# Altium schematic sheet SHEET1.SCHDOC
size B
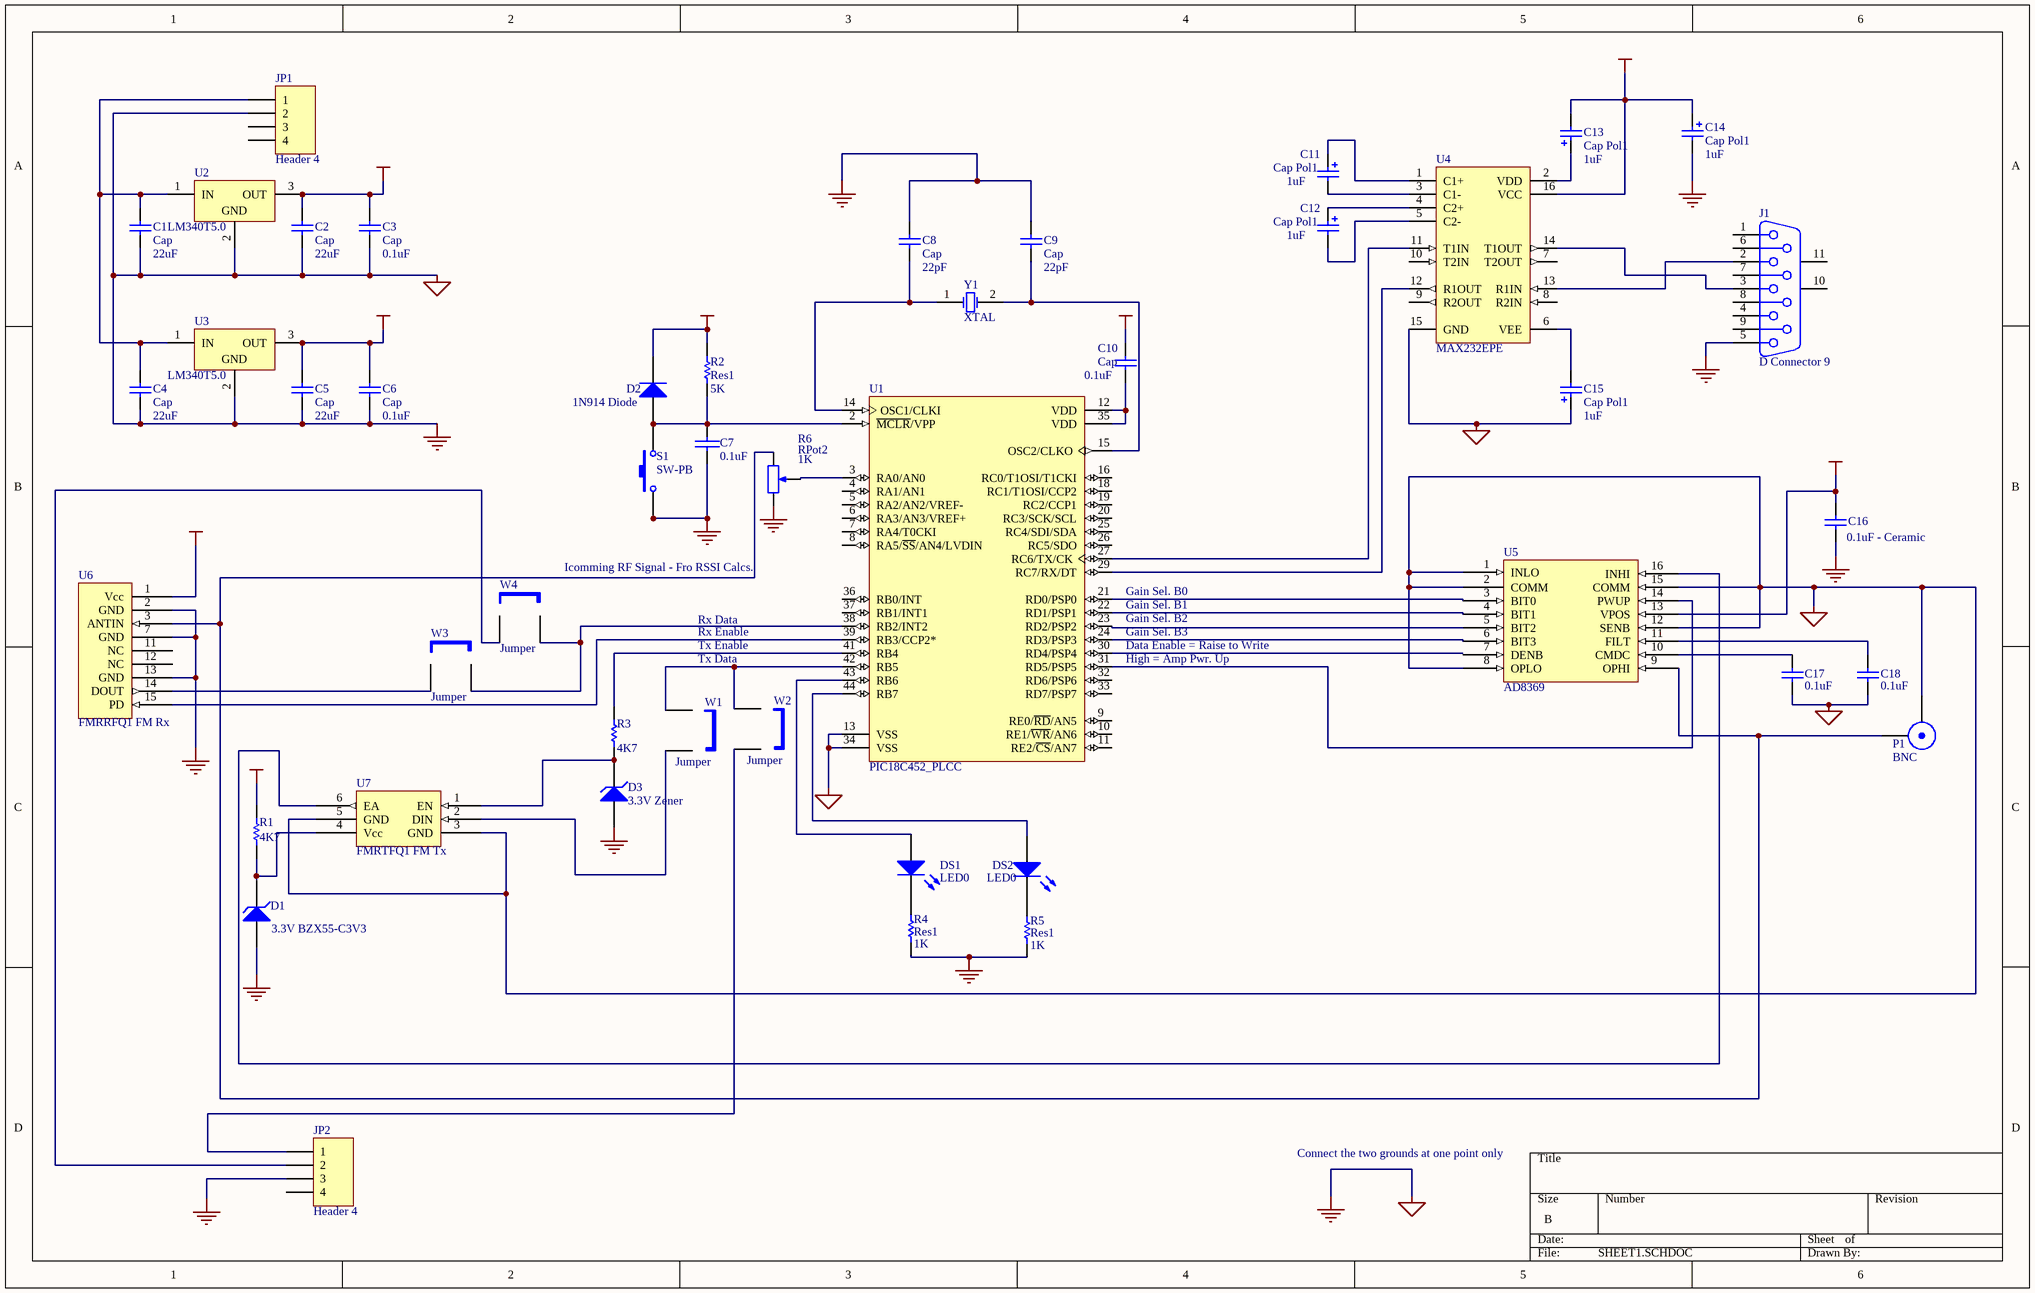
[diagram p0: SHEET1.SCHDOC]

## Parts
C1  Cap  value 22uF  [2mm Pol. Cap]
C2  Cap  value 22uF  [2mm Pol. Cap]
C3  Cap  value 0.1uF  [5mm Tant. Cap]
C4  Cap  value 22uF  [2mm Pol. Cap]
C5  Cap  value 22uF  [2mm Pol. Cap]
C6  Cap  value 0.1uF  [5mm Tant. Cap]
C7  0.1uF  [5mm Tant. Cap]
C8  Cap  value 22pF  [5.6mm Ceramic Cap]
C9  Cap  value 22pF  [5.6mm Ceramic Cap]
C10  Cap  value 0.1uF  [5mm Tant. Cap]
C11  Cap Pol1  value 1uF  [2mm Pol. Cap]
C12  Cap Pol1  value 1uF  [2mm Pol. Cap]
C13  Cap Pol1  value 1uF  [2mm Pol. Cap]
C14  Cap Pol1  value 1uF  [2mm Pol. Cap]
C15  Cap Pol1  value 1uF  [2mm Pol. Cap]
C16  value 0.1uF - Ceramic  [5mm Tant. Cap]
C17  value 0.1uF  [5mm Tant. Cap]
C18  value 0.1uF  [5mm Tant. Cap]
D1  3.3V BZX55-C3V3  [DIO7.1-3.9X1.9]
D2  1N914 Diode  [DIO7.1-3.9X1.9]
D3  3.3V Zener  [DIO7.1-3.9X1.9]
DS1  LED0  [LED]
DS2  LED0  [LED]
J1  D Connector 9  [DSUB1.385-2H9]
JP1  Header 4  [4 Way Terminal Block]
JP2  Header 4  [4 Way Terminal Block]
P1  BNC  [PCB BNC Connector - duplicate]
R1  value 4K7  [AXIAL-0.3]
R2  Res1  value 5K  [AXIAL-0.3]
R3  value 4K7  [AXIAL-0.3]  (hidden comment: Res1)
R4  Res1  value 1K  [AXIAL-0.3]
R5  Res1  value 1K  [AXIAL-0.3]
R6  RPot2  value 1K  [VR2]
S1  SW-PB  [Reset Switch - duplicate]
U1  PIC18C452_PLCC  [PLCC Socket 44 way]
U2  LM340T5.0  [SFM-T3/A4.7V]
U3  LM340T5.0  [SFM-T3/A4.7V]
U4  MAX232EPE  [DIP-16/X1.5]
U5  AD8369  [24 pin DIP socket for TSSOP]
U6  FMRRFQ1 FM Rx  [FMRRFQ1]
U7  FMRTFQ1 FM Tx  [FMRTFQ1]
W1  Jumper  [RAD-0.1]
W2  Jumper  [RAD-0.1]
W3  Jumper  [RAD-0.1]
W4  Jumper  [RAD-0.1]
Y1  XTAL  [XTAL]

## Nets
GND: C1.2 C2.2 C3.2 C4.2 C5.2 C6.2 C7.2 C8.2 C9.2 C14.2 C15.1 C16.2 C17.2 C18.2 D1.1(A) D3.1(A) J1.5 JP1.2 JP2.3 P1.2(Y) R4.2 R5.2 R6.1(TOP) S1.1 U1.13(VSS) U1.34(VSS) U2.2(GND) U3.2(GND) U4.15(GND) U5.12(SENB) U5.15(COMM) U6.2(GND) U6.7(GND) U6.13(GND) U7.3(GND) U7.5(GND)  [also labelled SGND]
VCC: C2.1 C3.1 C13.2 C14.1 C16.1 D2.2(K) R1.2 R2.2 U2.3(OUT) U4.16(VCC) U5.13(VPOS) U6.1(Vcc)
VDD: C5.1 C6.1 C10.1 U3.3(OUT)
NetC1_1: C1.1 C4.1 JP1.1 U2.1(IN) U3.1(IN)
NetC7_1: C7.1 D2.1(A) R2.1 S1.2 U1.2(~{MCLR}/VPP)
NetC8_1: C8.1 U1.14(OSC1/CLKI) Y1.1(OSC1)
NetC9_1: C9.1 U1.15(OSC2/CLKO) Y1.2(OSC2)
NetC10_2: C10.2 U1.12(VDD) U1.35(VDD)
NetC11_1: C11.1 U4.1(C1+)
NetC11_2: C11.2 U4.3(C1-)
NetC12_1: C12.1 U4.4(C2+)
NetC12_2: C12.2 U4.5(C2-)
NetC13_1: C13.1 U4.2(VDD)
NetC15_2: C15.2 U4.6(VEE)
NetC17_1: C17.1 U5.10(CMDC)
NetC18_1: C18.1 U5.11(FILT)
NetD1_2: D1.2(K) R1.1 U7.4(Vcc)
NetD3_2: D3.2(K) R3.1 U7.1(EN)
NetDS1_1: DS1.1(A) U1.43(RB6)
NetDS1_2: DS1.2(K) R4.1
NetDS2_1: DS2.1(A) U1.44(RB7)
NetDS2_2: DS2.2(K) R5.1
NetJ1_2: J1.2 U4.13(R1IN)
NetJ1_3: J1.3 U4.14(T1OUT)
NetJP2_1: JP2.1 W2.2
NetJP2_2: JP2.2 W4.1
NetP1_1: P1.1(X) R6.2(BOT) U5.9(OPHI) U6.3(ANTIN)
NetR3_2: R3.2 U1.41(RB4)
NetR6_3: R6.3(TAP) U1.3(RA0/AN0)
NetU1_21: U1.21(RD0/PSP0) U5.3(BIT0)
NetU1_22: U1.22(RD1/PSP1) U5.4(BIT1)
NetU1_23: U1.23(RD2/PSP2) U5.5(BIT2)
NetU1_24: U1.24(RD3/PSP3) U5.6(BIT3)
NetU1_27: U1.27(RC6/TX/CK) U4.11(T1IN)
NetU1_29: U1.29(RC7/RX/DT) U4.12(R1OUT)
NetU1_31: U1.31(RD5/PSP5) U5.14(PWUP)
NetU1_38: U1.38(RB2/INT2) W3.2 W4.2
NetU1_39: U1.39(RB3/CCP2*) U6.15(PD)
NetU1_42: U1.42(RB5) W1.1 W2.1
NetU5_1: U5.1(INLO) U5.2(COMM) U5.8(OPLO)
NetU5_16: U5.16(INHI) U7.6(EA)
NetU6_14: U6.14(DOUT) W3.1
NetU7_2: U7.2(DIN) W1.2

Not connected (* = marked no-connect by the designer): J1 1 4 6 7 8 9 10(MH1) 11(MH2); JP1 3 4; JP2 4; U1 4(RA1/AN1) 5(RA2/AN2/VREF-) 6(RA3/AN3/VREF+) 7(RA4/T0CKI) 8(RA5/~{SS}/AN4/LVDIN) 9(RE0/~{RD}/AN5) 10(RE1/~{WR}/AN6) 11(RE2/~{CS}/AN7) 16(RC0/T1OSI/T1CKI) 18(RC1/T1OSI/CCP2) 19(RC2/CCP1) 20(RC3/SCK/SCL) 25(RC4/SDI/SDA) 26(RC5/SDO) 30(RD4/PSP4) 32(RD6/PSP6) 33(RD7/PSP7) 36(RB0/INT) 37(RB1/INT1); U4 7(T2OUT) 8(R2IN) 9(R2OUT) 10(T2IN); U5 7(DENB); U6 11(NC) 12(NC)

## Notes on the sheet
- Icomming RF Signal - Fro RSSI Calcs.
- Rx Data
- Rx Enable
- (near U1) Gain Sel. B3
- (near U1) Gain Sel. B2
- (near U1) Gain Sel. B1
- (near U1) Gain Sel. B0
- Tx Enable
- Tx Data
- (near U1) High = Amp Pwr. Up
- (near U1) Data Enable = Raise to Write
- Connect the two grounds at one point only

## Library data of the parts
C1-C6 C8-C10 C16-C18 = Cap: Capacitor; Manufacturer: Generic Components; Class I: Passive; Published: 8-Jun-2000; Revision: July-2002: Re-released for DXP Platform.; Publisher: Altium Limited; Class II: Capacitor
C7 = CAP: Capacitor
C11-C15 = Cap Pol1: Polarized Capacitor (Radial); Manufacturer: Generic Components; Class I: Passive; Published: 8-Jun-2000; Revision: July-2002: Re-released for DXP Platform.; Publisher: Altium Limited; Class II: Capacitor
D1 D3 = D Zener: Zener Diode; Manufacturer: Generic Components; Class I: Discrete; Class II: Diode - Zener; Published: 8-Jun-2000; Revision: July-2002: Re-released for DXP Platform.; Publisher: Altium Limited
D2 = Diode: Default Diode; Manufacturer: Generic Components; Class I: Discrete; Class II: Diode - Switching; Published: 8-Jun-2000; Revision: July-2002: Re-released for DXP Platform.; Publisher: Altium Limited
DS1 DS2 = LED0: Typical INFRARED GaAs LED; Manufacturer: Generic Components; Class I: Optoelectronic; Published: 8-Jun-2000; Revision: July-2002: Re-released for DXP Platform.; Publisher: Altium Limited; Class II: LED
J1 = D Connector 9: Receptacle Assembly, 9 Position, Right Angle; Manufacturer: Generic Components; Package Information: Latest Revision: O; Positions: 9; Published: 15-Jun-2001; Revision: July-2002: Re-released for DXP Platform.; Datasheet: (1-Sep-1999); Package Reference: 788750; Publisher: Altium Limited; Class I: Connector; Orientation: Right Angle; Gender: Receptacle
JP1 JP2 = Header 4: Header, 4-Pin; Manufacturer: Generic Components; Class I: Connector; Revision: July-2002: Re-released for DXP Platform.; Publisher: Altium Limited
P1 = BNC: BNC Elbow Connector; Manufacturer: Generic Components; Class II: RF Coaxial; Revision: July-2002: Re-released for DXP Platform.; Publisher: Altium Limited; Class I: Connector
R1-R5 = Res1: Resistor; Manufacturer: Generic Components; Class I: Passive; Published: 8-Jun-2000; Revision: July-2002: Re-released for DXP Platform.; Publisher: Altium Limited; Class II: Resistor
R6 = RPot2: Potentiometer; Manufacturer: Generic Components; Class I: Passive; Set Position: 0.5; Published: 8-Jun-2000; Revision: July-2002: Re-released for DXP Platform.; Publisher: Altium Limited; Class II: Potentiometer
S1 = SW-PB: Switch; Manufacturer: Generic Components; Published: 24-Mar-1999; Revision: July-2002: Re-released for DXP Platform.; Publisher: Altium Limited
U2 U3 = LM340T5.0: Series 3-Terminal Positive Regulator; Manufacturer: National Semiconductor; Package Information: Latest Revision: 1995; Class I: Power Management; Class II: Voltage Regulator; Note: Tab is connected to GND; Published: 15-Apr-2002; Datasheet: Latest Revision: Jan-1995; Package Reference: T03B; Publisher: Altium Limited
U4 = MAX232EPE: +5V Powered RS-232 Driver/Receiver; Manufacturer: Maxim; Class I: Communication; Class II: Transceiver; Published: 16-Jan-2001; Revision: July-2002: Re-released for DXP Platform.; Datasheet: Latest Revision: Apr-1992; Package Reference: PE16A; Publisher: Altium Limited
U5 = AD8369_DIGITAL_CONT_PWR_AMP
U6 = FMRRFQ1
U7 = FMRTFQ1
W1-W4 = Jumper: Jumper Wire; Manufacturer: Generic Components; Published: 24-Mar-1999; Revision: July-2002: Re-released for DXP Platform.; Publisher: Altium Limited
Y1 = XTAL: Crystal Oscillator; Manufacturer: Generic Components; Published: 8-Jun-2000; Revision: July-2002: Re-released for DXP Platform.; Publisher: Altium Limited; Class I: Oscillator; Class II: Crystal Oscillator